# EAGLE design esp32_hub75 (EAGLE 7.7.0)
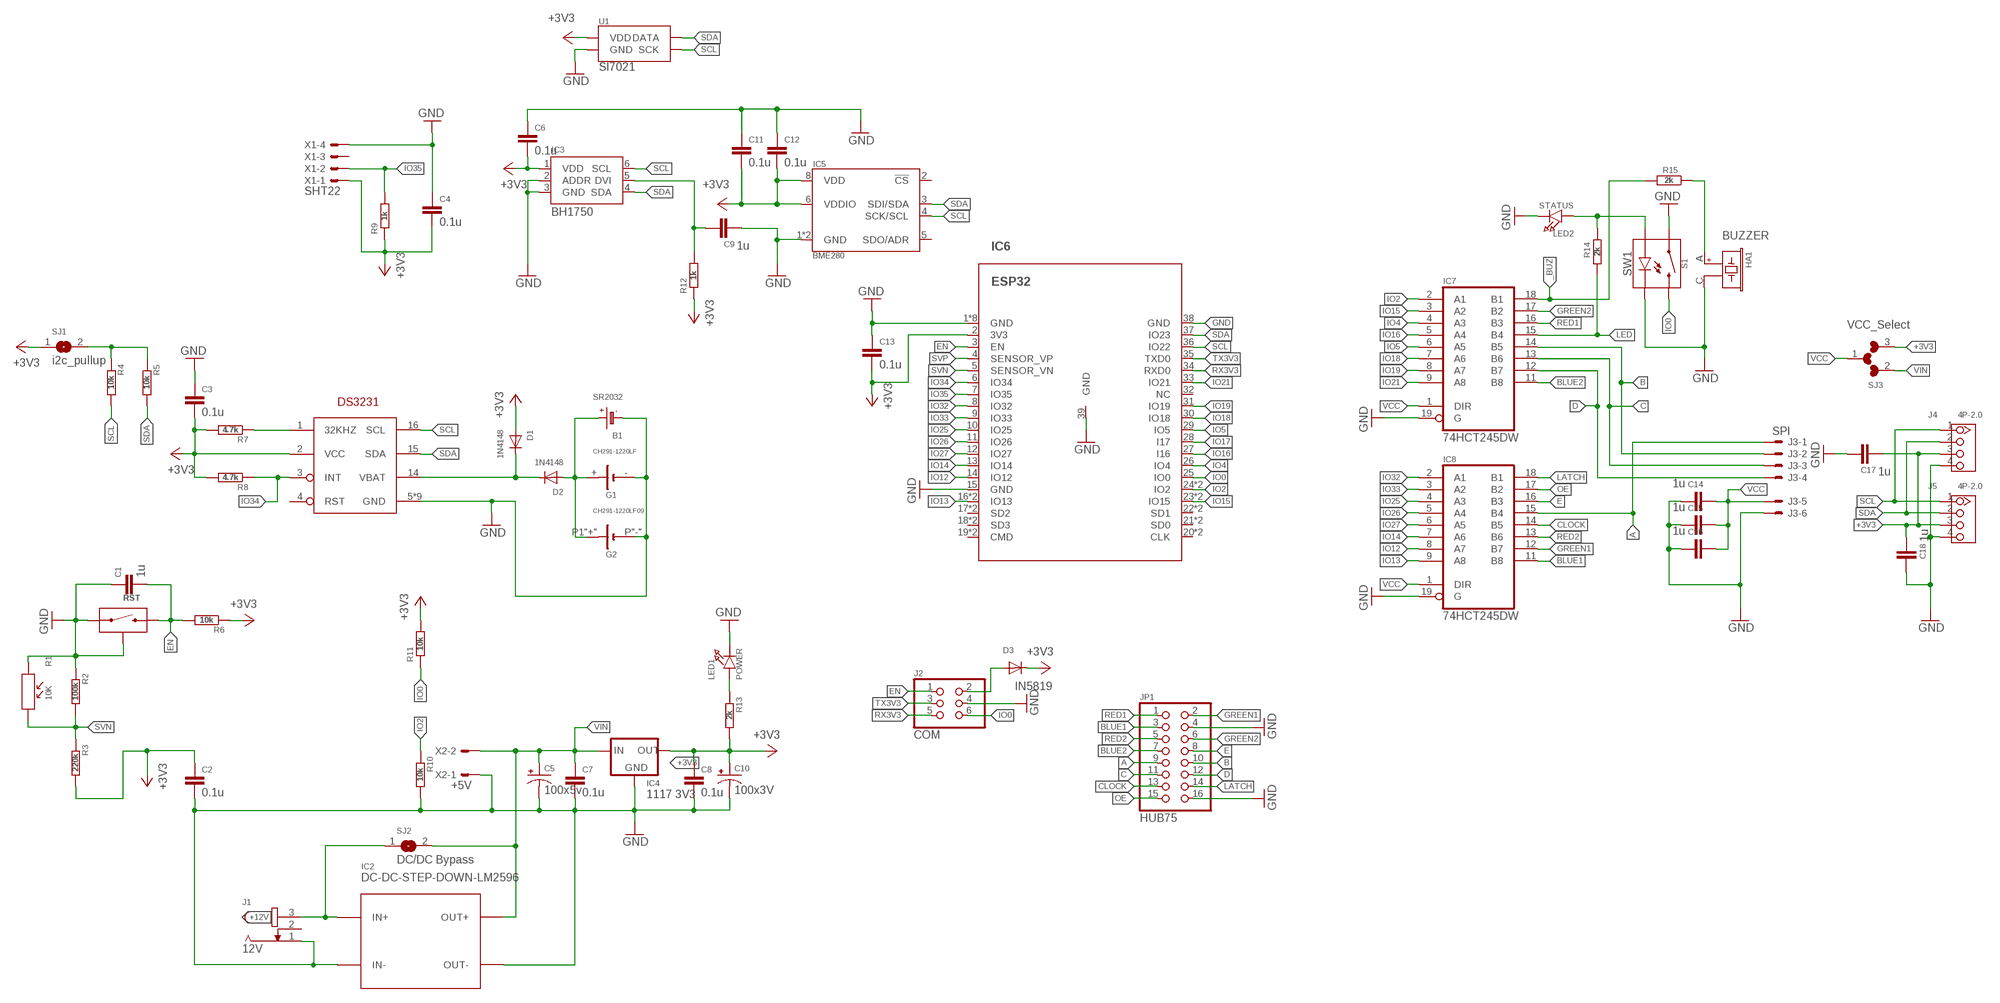
[diagram p0: schematic, sheet 1]

## Parts
B1  SR2032  BATTERYCR2032  [CR2032]
C1  1u  CAP0603-CAP  [0603-CAP]
C2  0.1u  CAP0603-CAP  [0603-CAP]
C3  0.1u  CAP0603-CAP  [0603-CAP]
C4  0.1u  CAP0603-CAP  [0603-CAP]
C5  100x5v  CAP_POLPTH1  [CPOL-RADIAL-100UF-25V]
C6  0.1u  CAP0603-CAP  [0603-CAP]
C7  0.1u  CAP0603-CAP  [0603-CAP]
C8  0.1u  CAP0603-CAP  [0603-CAP]
C9  1u  CAP0603-CAP  [0603-CAP]
C10  100x3V  CAP_POLPTH1  [CPOL-RADIAL-100UF-25V]
C11  0.1u  CAP0603-CAP  [0603-CAP]
C12  0.1u  CAP0603-CAP  [0603-CAP]
C13  0.1u  CAP0603-CAP  [0603-CAP]
C14  1u  CAP0603-CAP  [0603-CAP]
C15  1u  CAP0603-CAP  [0603-CAP]
C16  1u  CAP0603-CAP  [0603-CAP]
C17  1u  CAP0603-CAP  [0603-CAP]
C18  1u  CAP0603-CAP  [0603-CAP]
D1  1N4148  DIODESOD-323F  [SOD-323F]
D2  1N4148  DIODESOD-323F  [SOD-323F]
D3  IN5819  DIODE-SOD123  [SOD123]
G1  CH291-1220LF  [CH291-1220LF]
G2  CH291-1220LF09  [CH23-09LF]
HA1  BUZZER  PIEZO_BUZZERHYDZ12X7.5  [PBUZ_12X7.5]
IC1  DS3231W  [SO16W]
IC2  DC-DC-STEP-DOWN-LM2596  [DC-DC-STEP-DOWN-LM2596]
IC3  BH1750  [WSOF6L]
IC4  1117 3V3  V_REG_LD1117VXXSMD  [SOT223]
IC5  BME280  [LGA-8-2.5X2.5]
IC6  ESP32  ESP32-MODULEDUAL  [ESP32-WROOVER/WROOM]
IC7  74HCT245DW  [SO20W]
IC8  74HCT245DW  [SO20W]
J1  12V  JACK-PLUG0  [SPC4077]
J2  COM  HEADER-2X3TH  [2X03]
J3  SPI  C-GRID-0670543  [70543-06]
J4  4P-2.0  GROVE-CONNECTOR-DIP(4P-2.0)  [HW4-2.0]
J5  4P-2.0  GROVE-CONNECTOR-DIP(4P-2.0)  [HW4-2.0]
JP1  HUB75  PINHD-2X8  [2X08]
LED1  POWER  LED0603  [CHIPLED_0603]
LED2  STATUS  LED0603  [CHIPLED_0603]
R1  10K  PHOTORESISTOR-5528-10K(2P-5.0X4.2MM)  [SNR2-3.0]
R2  100k  R-EU_R0603  [R0603]
R3  220k  R-EU_R0603  [R0603]
R4  10k  R-EU_R0603  [R0603]
R5  10k  R-EU_R0603  [R0603]
R6  10k  R-EU_R0603  [R0603]
R7  4.7k  R-EU_R0603  [R0603]
R8  4.7k  R-EU_R0603  [R0603]
R9  1k  R-EU_R0603  [R0603]
R10  10k  R-EU_R0603  [R0603]
R11  10k  R-EU_R0603  [R0603]
R12  1k  R-EU_R0603  [R0603]
R13  2k  R-EU_R0603  [R0603]
R14  2k  R-EU_R0603  [R0603]
R15  2k  R-EU_R0603  [R0603]
RST  RST  MICROSWITCH-BUTTON  [MICROPUSH-BUT_TOP]
S1  SW1  MOMENTARY-SWITCH-SPST-LED-PTH-12MM-KIT  [TACTILE_SWITCH_LED_PTH_12MM_KIT]
SJ1  i2c_pullup  MICROBUILDER_SOLDERJUMPER  [MICROBUILDER_SOLDERJUMPER_ARROW_NOPASTE]
SJ2  DC/DC Bypass  MICROBUILDER_SOLDERJUMPER  [MICROBUILDER_SOLDERJUMPER_ARROW_NOPASTE]
SJ3  VCC_Select  MICROBUILDER_SOLDERJUMPER3  [MICROBUILDER_SOLDERJUMPER_ARROW_NOPASTE_3]
U1  SI7021  [DFN-6-3X3-SI7021]
X1  SHT22  C-GRID-04-70543  [70543-04]
X2  +5V  C-GRID-02-70543  [70543-02]

## Nets
+3V3: C2.1 C3.2 C4.2 C6.2 C8.1 C10.1(+) C11.2 C12.2 C13.2 C17.2 C18.2 D1.A D3.C IC1.2(VCC) IC3.1(VDD) IC4.2(OUT) IC4.4(OUT) IC5.6(VDDIO) IC5.8(VDD) IC6.2(3V3) J4.3 J5.3 R3.2 R6.1 R7.2 R8.2 R9.1 R11.2 R12.1 R13.2 SJ1.1 SJ3.3 U1.VDD X1.1
+12V: IC2.IN+ J1.3 SJ2.1
_BUZ: IC7.18(B1) R15.2
A: IC8.15(B4) J3.1 JP1.9
B: IC7.14(B5) J3.2 JP1.10
BLUE1: IC8.11(B8) JP1.3
BLUE2: IC7.11(B8) JP1.7
BUZ: HA1.A R15.1
C: IC7.13(B6) J3.3 JP1.11
CLOCK: IC8.14(B5) JP1.13
D: IC7.12(B7) J3.4 JP1.12
E: IC8.16(B3) JP1.8
EN: C1.2 IC6.3(EN) J2.1 R6.2 RST.B
GND: B1.- C1.1 C2.2 C3.1 C4.1 C5.2(-) C6.1 C7.2 C8.2 C9.2 C10.2(-) C11.1 C12.1 C13.1 C14.2 C15.2 C16.2 C17.1 C18.1 G1.- G2.P"-"(-) HA1.C IC1.5(GND) IC1.6(GND) IC1.7(GND) IC1.8(GND) IC1.9(GND) IC1.10(GND) IC1.11(GND) IC1.12(GND) IC1.13(GND) IC2.IN- IC2.OUT- IC3.2(ADDR) IC3.3(GND) IC4.1(GND) IC5.1(GND) IC5.7(GND) IC6.1(GND) IC6.15(GND) IC6.38(GND) IC6.39(GND) IC6.GND IC6.PAD$1(GND) IC6.PAD$4(GND) IC6.PAD$5(GND) IC6.PAD$7(GND) IC6.PAD$8(GND) IC6.PAD$9(GND) IC7.19(G) IC8.19(G) J1.1 J2.4 J3.6 J4.4 J5.4 JP1.4 JP1.16 LED1.C LED2.C R1.1 R2.1 R10.2 RST.A RST.SH0(SH) S1.3 S1.4 S1.C U1.GND X1.4 X2.1
GREEN1: IC8.12(B7) JP1.2
GREEN2: IC7.17(B2) JP1.6
IO0: IC6.25(IO0) J2.6 R11.1 S1.1 S1.2
IO2: IC6.24(IO2) IC6.48(IO2) IC7.2(A1) R10.1
IO4: IC6.26(IO4) IC7.4(A3)
IO5: IC6.29(IO5) IC7.6(A5)
IO12: IC6.14(IO12) IC8.8(A7)
IO13: IC6.16(IO13) IC6.40(IO13) IC8.9(A8)
IO14: IC6.13(IO14) IC8.7(A6)
IO15: IC6.23(IO15) IC6.47(IO15) IC7.3(A2)
IO16: IC6.27(I16) IC7.5(A4)
IO17: IC6.28(I17)
IO18: IC6.30(IO18) IC7.7(A6)
IO19: IC6.31(IO19) IC7.8(A7)
IO21: IC6.33(IO21) IC7.9(A8)
IO25: IC6.10(IO25) IC8.4(A3)
IO26: IC6.11(IO26) IC8.5(A4)
IO27: IC6.12(IO27) IC8.6(A5)
IO32: IC6.8(IO32) IC8.2(A1)
IO33: IC6.9(IO33) IC8.3(A2)
IO34: IC1.3(INT) IC6.6(IO34) R8.1
IO35: IC6.7(IO35) R9.2 X1.2
LATCH: IC8.18(B1) JP1.14
LED: IC7.15(B4) R14.2
N$1: D1.C D2.C IC1.14(VBAT)
N$2: LED1.A R13.1
N$5: LED2.A R14.1 S1.A
N$25: C9.1 IC3.5(DVI) R12.2
N$32: IC1.1(32KHZ) R7.1
N$39: R4.1 R5.1 SJ1.2
N$47: D3.A J2.2
N$52: B1.+ D2.A G1.+ G2.P1"+"(+)
OE: IC8.17(B2) JP1.15
RED1: IC7.16(B3) JP1.1
RED2: IC8.13(B6) JP1.5
RX3V3: IC6.34(RXD0) J2.5
SCL: IC1.16(SCL) IC3.6(SCL) IC5.4(SCK/SCL) IC6.36(IO22) J4.1 J5.1 R4.2 U1.SCK
SDA: IC1.15(SDA) IC3.4(SDA) IC5.3(SDI/SDA) IC6.37(IO23) J4.2 J5.2 R5.2 U1.DATA
SVN: IC6.5(SENSOR_VN) R1.2 R2.2 R3.1
SVP: IC6.4(SENSOR_VP)
TX3V3: IC6.35(TXD0) J2.3
VCC: C14.1 C15.1 C16.1 IC7.1(DIR) IC8.1(DIR) J3.5 SJ3.1
VIN: C5.1(+) C7.1 IC2.OUT+ IC4.3(IN) SJ2.2 SJ3.2 X2.2
Unconnected: IC1.4(RST) IC5.2(!CS) IC5.5(SDO/ADR) IC6.17(SD2) IC6.18(SD3) IC6.19(CMD) IC6.20(CLK) IC6.21(SD0) IC6.22(SD1) IC6.32(NC) IC6.41(SD2) IC6.42(SD3) IC6.43(CMD) IC6.44(CLK) IC6.45(SD0) IC6.46(SD1) J1.2 X1.3

## Power pins joined to a net without a drawn wire
GND: IC7.10(GND) IC8.10(GND)
VCC: IC7.20(VCC) IC8.20(VCC)

## Library data of the parts
B1 = radiva5:BATTERY: CR1220 SMT - Digikey: 3001K-ND
C1-C4 C6-C9 C11-C18 = radiva5:CAP: Capacitor Standard 0603 ceramic capacitor, and 0.1" leaded capacitor.
C5 C10 = radiva5:CAP_POL: Capacitor Polarized These are standard SMD and PTH capacitors. Normally 10uF, 47uF, and 100uF in electrolytic and tantalum varieties. Always verify the external diameter of the through hole cap, it varies with capacity, voltage, and manufacturer. The EIA devices should be standard.
D1 D2 = clock02:DIODE: Diode SMADIODE - SMA Surface Mount Package 20V 1A Schottky Diode Digikey: 641-1014-6-ND DO-1N4148 - Through Hole Small Current Diode SOD-123 20V 1 A (.5mV Vf) Schottky Diode - Digikey: MBRX120TPMSCT-ND SOD-323 10V 570mA (.38mV Vf, 3ns) Schottky Diode - Digikey: ZLLS410CT-ND SOD-523 30V 30mA Schottky Diode (RB751S-40TE61) - Digikey: RB751S-40TE61CT-ND SOT23-R/W - SOT23 Package (R = Solder Paste/Reflow Ovens, W = Hand-Soldering) BAT54Film 40V 300mA - Digikey: 497-7162-1-ND
D3 = radiva5:DIODE-: DIODE
G1 G2 = clock02:CH291-1220LF: Battery Holder, SMT, 12mm multicomp PART NO. CH291-1220LF Source: Data sheet <http://www.farnell.com/datasheets/1505860.pdf>
HA1 = radiva5:PIEZO_BUZZER: Generic Piezo Buzzer Package(s): 12 mm dia, 7.6 mm (Pitch)
IC1 = radiva5:DS3231
IC2 = diy-modules:DC-DC-STEP-DOWN-LM2596: DC/DC Step-Down Regulator based on LM2596-ADJ chip LM2596 datasheet available here: http://www.ti.com/lit/ds/symlink/lm2596.pdf Click here to find device on ebay.com <http://www.ebay.com/sch/lm2596+power+regulator>
IC3 = radiva5:BH1750; PROD_ID: IC-13876; VALUE: ZOPT2201
IC4 = radiva5:V_REG_LD1117VXX: LD1117VXX voltage regulator. We carry the 3.3V version (COM-00526) in TO-220 package.; PROD_ID: VREG-13917
IC5 = radiva5:BME280: Bosch BME280 – Combined Humidity and Pressure Sensor The BME280 is as combined digital humidity, pressure and temperature sensor based on proven sensing principles. The sensor module is housed in an extremely compact metal-lid LGA package with a footprint of only 2.5×2.5mm² with a height of 0.93mm. Its small dimensions and its low power consumption allow the implementation in battery driven devices such as handsets, GPS modules or watches. Datasheet <https://cdn.sparkfun.com/assets/learn_tutorials/4/1/9/BST-BME280_DS001-10.pdf> SparkFun Products SparkFun Atmospheric Sensor Breakout - BME280 <https://www.sparkfun.com/products/13676> (SEN-13676); PROD_ID: IC-13090
IC6 = radiva5:ESP32-MODULE
IC7 IC8 = 74xx-eu:74*245: Octal BUS TRANSCEIVER, 3-state
J1 = con-jack:JACK-PLUG: DC POWER JACK Power Jack, DC, Right Angle, Through Hole, Rated 5A at 16VDC, PC Terminals Distributor: Farnell (www.Farnell.de) Drawing: 84N1161.pdf / 84N1162.pdf Manufacturer: SPC Technology (www.spctechnology.com) Type: SPC4077 / SPC 4078; OC_FARNELL: unknown; OC_NEWARK: unknown
J2 = radiva5:HEADER-2X3: PIN HEADER
J3 = clock02:C-GRID-06: CONNECTOR wire to board 2.54 mm (0.100") pitch header
J4 J5 = radiva5:GROVE-CONNECTOR-DIP(4P-2.0): 320110033
JP1 = pinhead:PINHD-2X8: PIN HEADER
LED1 LED2 = radiva5:LED: LED 0603 - 0603 Surface Mount Package 2mA: Green LED - Low Power (3.9mcd, 2ma, 1.7Vf) - Digikey: 475-2709-2-ND Orange LED - Low Power (9.8mcd, 2ma, 1.8Vf) - Digikey: 475-1194-2-ND Red LED - Low Power (5mcd, 2ma, 1.8Vf) - Digikey: 475-1195-2-ND Yellow LED - Low Power (7mcd, 2ma, 1.8Vf) - Digikey: 475-1196-2-ND 5mA: Blue LED - Low Power (17mcd, 5ma, 2.9Vf) - Digikey: LNJ937W8CRACT-ND 0805 - 0805 Surface Mount Package 2mA: Red LED (8.8mcd, 2mA, 1.8Vf, Clear) - Low Power [Digikey: 475-2510-1-ND] Green LED (5mcd, 2mA, 1.8Vf, Clear) - Low Power [Digikey: 475-2730-1-ND] Yellow LED (11.3mcd, 2mA, 1.8Vf, Clear) - Low Power [Digikey: 475-2555-1-ND] 20mA: Red LED (104mcd, 20mA, Diffused) - LS R976 [Digikey: 475-1278-6-ND] Red LED (12mcd, 20mA, 2.0Vf, Clear) - APT2012EC [Digikey: 754-1128-1-ND] Green LED (15mcd, 20mA, 2.2Vf, Clear) - APT2012GC [Digikey: 754-1131-1-ND] Orange LED (160mcd, 20mA, 2.1Vf, Clear) - APT2012SECK [Digikey: 754-1130-1-ND] 1206 - 1206 Surface Mount Package Green LED (26mcd, 20mA, Diffused) - LG N971 [Digikey: 475-1407-6-ND] Red LED (15mcd, 20mA, Diffused) - LH N974 [Digikey: 475-1416-6-ND]
R1 = radiva5:PHOTORESISTOR-5528-10K(2P-5.0X4.2MM): 314020017; MPN: PHOTORESISTOR-5528-10K; VALUE: PHOTORESISTOR-5528-10K
R2-R15 = radiva5:R-EU_: RESISTOR, European symbol
RST = radiva5:MICROSWITCH-BUTTON
S1 = radiva5:MOMENTARY-SWITCH-SPST-LED: Momentary Switch (Pushbutton) - SPST - w/ LED Normally-open (NO) SPST momentary switches (buttons, pushbuttons), with a built-in LED. Variants PTH-CHERRY - Cherry MX Switch Cherry MX Keyswitches are top-of-the-line mechanical keyboard switches. Theyre satisfyingly clicky, reliable up to tens-of-millions of key presses, and a standard in gaming and programming keyboards across the globe. This blue version Cherry MX Switch is favored by most due to its secondary internal actuator making it less likely to double-tap. If you are looking for a noticeably audible and high-quality key switch, this is the perfect option for you! Cherry MX Switch <https://www.sparkfun.com/products/13834> (COM-13834) Cherry MX Switch Breakout <https://www.sparkfun.com/products/13773> (BOB-13773) PTH-12MM and PTH-12MM-KIT - 12mm Illuminated LED KIT variant is for soldering kits. There is no tStop (covering up the top side of the pads with mask). This helps the beginner see which side they should be soldering too. LED Tactile Button Breakout <https://www.sparkfun.com/products/10467> (BOB-10467) LED Tactile Button - Red <https://www.sparkfun.com/products/10442> (COM-10442) LED Tactile Button - Blue <https://www.sparkfun.com/products/10443> (COM-10443) LED Tactile Button - Green <https://www.sparkfun.com/products/10440> (COM-10440) LED Tactile Button - Orange <https://www.sparkfun.com/products/10441> (COM-10441) LED Tactile Button - White <https://www.sparkfun.com/products/10439> (COM-10439); PROD_ID: SWCH-11758; SF_SKU: COM-10442
SJ1 SJ2 = radiva5:MICROBUILDER_SOLDERJUMPER: SMD Solder JUMPER Solder the two pads together to create a connection, or remove the solder to break it. REFLOW - Use this footprint for solder paste and reflow ovens. WAVE - Use this footprint for hand-soldering (larger pads). CLOSED - Has a trace between the two pads to ensure it is closed by default. The trace needs to be cut to disable the jumper, and can be closed again by creating a solder bridge between the two pads.; BOM: EXCLUDE
SJ3 = radiva5:MICROBUILDER_SOLDERJUMPER3: SMD Solder JUMPER Solder the two pads together to create a connection, or remove the solder to break it. REFLOW - Use this footprint for solder paste and reflow ovens. WAVE - Use this footprint for hand-soldering (larger pads). CLOSED - Has a trace between the two pads to ensure it is closed by default. The trace needs to be cut to disable the jumper, and can be closed again by creating a solder bridge between the two pads.
U1 = radiva5:SI7021: Silicon Labs Si7021 I2C Humidity and Temperature Sensor The Si7021 is a low-cost, easy-to-use, highly accurate, digital humidity and temperature sensor. This sensor is ideal for environmental sensing and data logging and perfect for build a weather stations or humidor control system. All you need are two lines for I2C communication, and you’ll have relative humidity readings and very accurate temperature readings as a bonus! Datasheet <https://cdn.sparkfun.com/datasheets/Sensors/Weather/Si7021.pdf> SparkFun Products SparkFun Humidity and Temperature Sensor Breakout - Si7021 <https://www.sparkfun.com/products/13763> (SEN-13763) SparkFun Blynk Board - ESP8266 <https://www.sparkfun.com/products/13794> (WRL-13794); PROD_ID: IC-13093
X1 = con-molex:C-GRID-04: CONNECTOR wire to board 2.54 mm (0.100") pitch header; OC_FARNELL: unknown; OC_NEWARK: unknown
X2 = con-molex:C-GRID-02: CONNECTOR wire to board 2.54 mm (0.100") pitch header; OC_FARNELL: unknown; OC_NEWARK: unknown

## Net classes
0 default: clearance 0.205 mm
1 power: width 0.406 mm

## Board
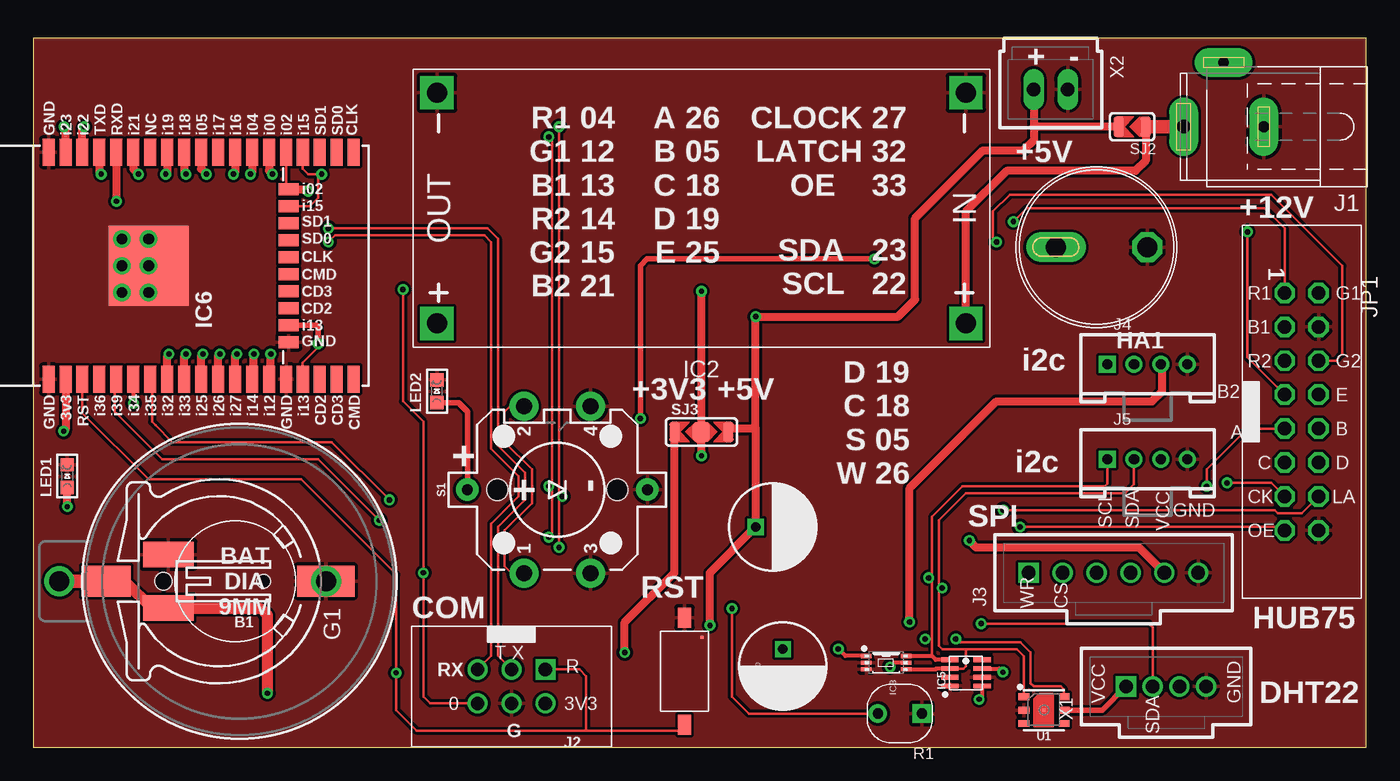
[diagram p1: board, top side]
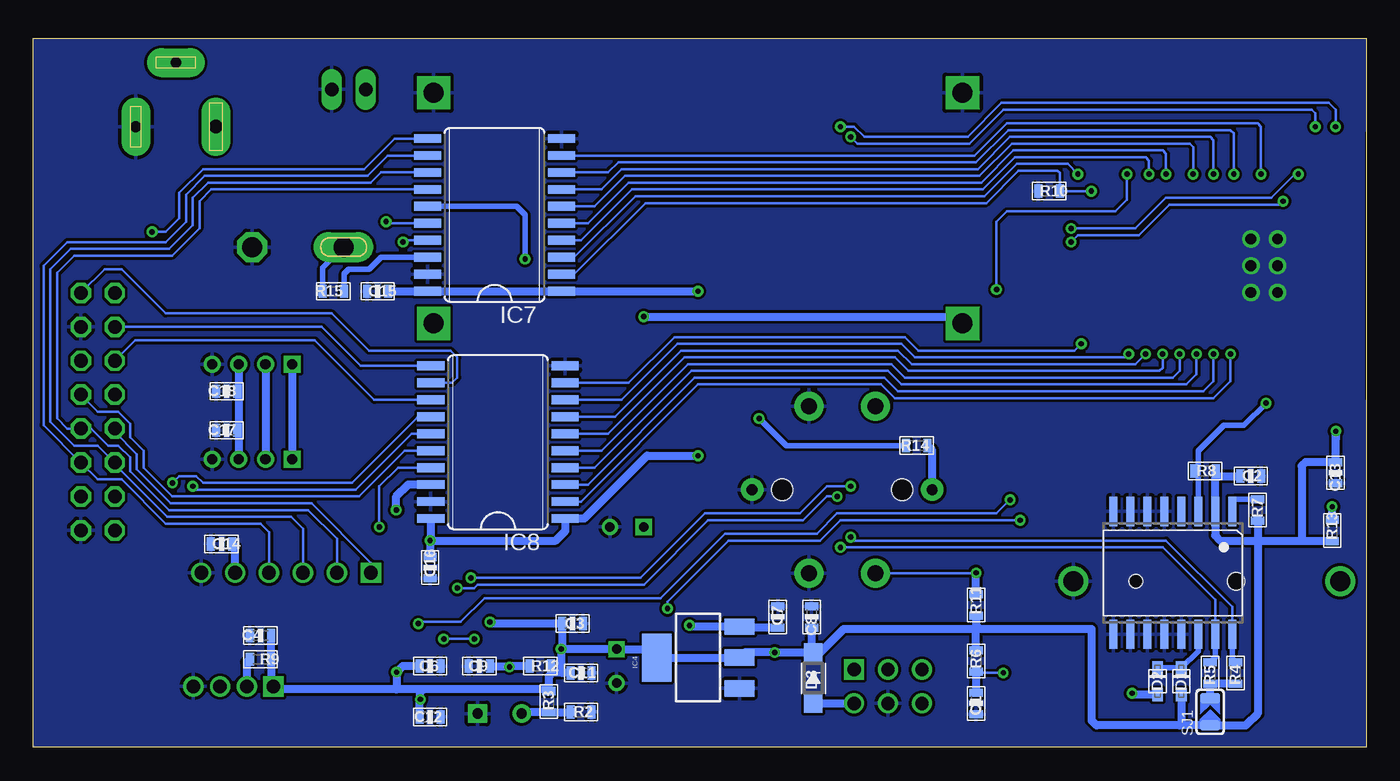
[diagram p2: board, bottom side, seen from below]

Size 99.82 x 53.09 mm. Coordinates in mm from the lower left corner, seen from the top.
Outline: 0,53.09 0,0 99.82,0 99.82,53.09 0,53.09
Copper layers (1*16): Top 0.035mm / dielectric 1.5mm / Bottom 0.035mm
Design rules "default *": minimum track width 8mil, minimum drill 15mil, track to track 8mil, track to pad 8mil, pad to pad 8mil, via to via 8mil, smd to smd 8mil, copper to edge 1mil, drill to drill 8mil, minimum pad ring 10mil, minimum via ring 8mil, stop-mask expansion 4mil, vias tented up to drill 20mil, thermal gap 10mil

### Footprints (pad centres in the part's own frame; a part is rotated, then mirrored left to right if it is on the bottom)
CR2032 = drill 1.5: + 13.81,0; - -6.19,0
0603-CAP = smd 0.6 x 1: 1 -0.8,0; 2 0.8,0
CPOL-RADIAL-100UF-25V = drill 0.7 square: 1 1.27,0 | drill 0.7: 2 -1.27,0
SOD-323F = smd 1 x 0.8: A -1,0; C 1,0
SOD123 = smd 1.4 x 1.4: A 1.9,0; C -1.9,0
CH291-1220LF = smd 2.3 x 3.66: + 0,-2.296 | smd 2.3 x 4.3: - 0,14.146 | hole 1.3: 0,2 | hole 1: 0,9.5
CH23-09LF = smd 3.81 x 1.93: P1"+" 5,2; P"-" 5,-2
PBUZ_12X7.5 = drill 1.5 long: A 3.038,0 | drill 1.5 octagon: C -3.8,0
SO16W = smd 0.6 x 2.2: 1 -4.445,-4.6; 2 -3.175,-4.6; 3 -1.905,-4.6; 4 -0.635,-4.6; 5 0.635,-4.6; 6 1.905,-4.6; 7 3.175,-4.6; 8 4.445,-4.6; 9 4.445,4.6; 10 3.175,4.6; 11 1.905,4.6; 12 0.635,4.6; 13 -0.635,4.6; 14 -1.905,4.6; 15 -3.175,4.6; 16 -4.445,4.6
DC-DC-STEP-DOWN-LM2596 = drill 1.5 pad 2.5 square: IN+ -19.812,8.636; IN- -19.812,-8.636; OUT+ 19.812,8.636; OUT- 19.812,-8.636
WSOF6L = smd 0.3 x 0.8: 1 -0.5,-1.5; 2 0,-1.5; 3 0.5,-1.5; 4 0.5,1.5; 5 0,1.5; 6 -0.5,1.5
SOT223 = smd 1.219 x 2.235: 1 -2.311,-3.099; 2 0,-3.099; 3 2.311,-3.099 | smd 3.6 x 2.2: 4 0,3.099
LGA-8-2.5X2.5 = smd 0.35 x 1.3: 1 -0.975,1.2; 2 -0.325,1.2; 3 0.325,1.2; 4 0.975,1.2; 5 0.975,-1.2; 6 0.325,-1.2; 7 -0.325,-1.2; 8 -0.975,-1.2
ESP32-WROOVER/WROOM = smd 2 x 0.9: 1 -8.5,7.5; 2 -8.5,6.23; 3 -8.5,4.96; 4 -8.5,3.69; 5 -8.5,2.42; 6 -8.5,1.15; 7 -8.5,-0.12; 8 -8.5,-1.39; 9 -8.5,-2.66; 10 -8.5,-3.93; 11 -8.5,-5.2; 12 -8.5,-6.47; 13 -8.5,-7.74; 14 -8.5,-9.01; 15 -8.5,-10.28; 16 -8.5,-11.55; 17 -8.5,-12.82; 18 -8.5,-14.09; 19 -8.5,-15.36; 20 8.5,-15.36; 21 8.5,-14.09; 22 8.5,-12.82; 23 8.5,-11.55; 24 8.5,-10.28; 25 8.5,-9.01; 26 8.5,-7.74; 27 8.5,-6.47; 28 8.5,-5.2; 29 8.5,-3.93; 30 8.5,-2.66; 31 8.5,-1.39; 32 8.5,-0.12; 33 8.5,1.15; 34 8.5,2.42; 35 8.5,3.69; 36 8.5,4.96; 37 8.5,6.23; 38 8.5,7.5 | smd 0.9 x 1.5: 39 -5.725,-10.5; 40 -4.445,-10.5; 41 -3.175,-10.5; 42 -1.905,-10.5; 43 -0.635,-10.5; 44 0.635,-10.5; 45 1.905,-10.5; 46 3.175,-10.5; 47 4.445,-10.5; 48 5.715,-10.5 | smd 6 x 6: GND 0,0 | drill 0.8: PAD$1 -2,2; PAD$4 0,2; PAD$5 2,2; PAD$7 -2,0; PAD$8 0,0; PAD$9 2,0
SO20W = smd 0.66 x 2.032: 1 -5.715,-5.029; 2 -4.445,-5.029; 3 -3.175,-5.029; 4 -1.905,-5.029; 5 -0.635,-5.029; 6 0.635,-5.029; 7 1.905,-5.029; 8 3.175,-5.029; 9 4.445,-5.029; 10 5.715,-5.029; 11 5.715,5.029; 12 4.445,5.029; 13 3.175,5.029; 14 1.905,5.029; 15 0.635,5.029; 16 -0.635,5.029; 17 -1.905,5.029; 18 -3.175,5.029; 19 -4.445,5.029; 20 -5.715,5.029
SPC4077 = drill 0.8 pad 2.184 long: 1 -3,0; 2 0,-4.8 | drill 1 pad 2.184 long: 3 3,0
2X03 = drill 1 square: 1 -2.54,-1.27 | drill 1: 2 -2.54,1.27; 3 0,-1.27; 4 0,1.27; 5 2.54,-1.27; 6 2.54,1.27
70543-06 = drill 1.016 square: 1 -5.08,0 | drill 1.016: 2 -2.54,0; 3 0,0; 4 2.54,0; 5 5.08,0; 6 7.62,0
HW4-2.0 = drill 0.762 pad 1.27 square: 1 -3,0 | drill 0.762 pad 1.27: 2 -1,0; 3 1,0; 4 3,0
2X08 = drill 1.016 octagon: 1 -8.89,-1.27; 2 -8.89,1.27; 3 -6.35,-1.27; 4 -6.35,1.27; 5 -3.81,-1.27; 6 -3.81,1.27; 7 -1.27,-1.27; 8 -1.27,1.27; 9 1.27,-1.27; 10 1.27,1.27; 11 3.81,-1.27; 12 3.81,1.27; 13 6.35,-1.27; 14 6.35,1.27; 15 8.89,-1.27; 16 8.89,1.27
CHIPLED_0603 = smd 1 x 1: A 0,-0.85; C 0,0.85
SNR2-3.0 = drill 0.762 pad 1.397 square: 1 -1.651,0 | drill 0.762 pad 1.397: 2 1.651,0
R0603 = smd 0.6 x 1: 1 -0.8,0; 2 0.8,0
MICROPUSH-BUT_TOP = smd 1.5 x 1: A -4,0; B 4,0 | smd 0.2 x 0.2: SH0 -2.54,1.31
TACTILE_SWITCH_LED_PTH_12MM_KIT = drill 1.2 pad 2.159: 1 -6.25,2.5; 2 6.25,2.5; 3 -6.25,-2.5; 4 6.25,-2.5 | drill 0.8 pad 1.676: A 0,6.75; C 0,-6.75 | hole 1.6: 0,4.5; 0,-4.5
MICROBUILDER_SOLDERJUMPER_ARROW_NOPASTE = smd 0.762 x 1.524: 1 -1.016,0; 2 1.016,0
MICROBUILDER_SOLDERJUMPER_ARROW_NOPASTE_3 = smd 1.27 x 1.524: 1 0,0 | smd 0.762 x 1.524: 2 2.032,0; 3 -2.032,0
DFN-6-3X3-SI7021 = smd 0.2 x 0.2: 7 0,0 | smd 0.8 x 0.5: DATA 1.5,-1; GND 1.5,0; NC@3 1.5,1; NC@4 -1.5,1; SCK -1.5,-1; VDD -1.5,0
70543-04 = drill 1.016 square: 1 -3,0 | drill 1.016: 2 -1,0; 3 1,0; 4 3,0
70543-02 = drill 1.016 long: 1 -1.27,0; 2 1.27,0

### Placement (x,y rotation side)
B1  15.75,12.45 180 top
C1  29.21,3.3 90 bottom
C2  8.64,20.32 0 bottom
C3  59.44,9.27 180 bottom
C4  82.8,8.38 0 bottom
C5  55.37,16.51 180 top
C6  70.1,6.1 180 bottom
C7  44.07,9.78 90 bottom
C8  41.53,9.78 90 bottom
C9  66.42,6.1 180 bottom
C10  56.13,6.1 90 top
C11  58.8,5.59 180 bottom
C12  70.1,2.29 180 bottom
C13  2.29,20.57 90 bottom
C14  85.72,15.24 180 bottom
C15  74.04,34.16 180 bottom
C16  70.1,13.46 270 bottom
C17  85.34,23.75 0 bottom
C18  85.34,26.67 0 bottom
D1  13.84,4.95 90 bottom
D2  15.62,4.95 90 bottom
D3  41.4,5.21 270 bottom
G1  7.75,12.45 270 top
G2  15.11,12.45 180 top
HA1  79.63,37.47 180 top
IC1  14.48,13.08 180 bottom
IC2  50.04,40.39 180 top
IC3  63.88,6.35 270 top
IC4  50.04,6.73 90 bottom
IC5  69.85,5.59 90 top
IC6  8.64,36.07 90 top
IC7  65.28,39.88 90 bottom
IC8  65.02,22.86 90 bottom
J1  89.15,46.48 180 top
J2  35.81,4.57 180 top
J3  79.63,13.08 0 top
J4  83.44,28.7 0 top
J5  83.44,21.59 0 top
JP1  95,25.15 270 top
LED1  2.54,20.32 0 top
LED2  30.23,26.67 0 top
R1  64.9,2.54 180 top
R2  58.8,2.67 180 bottom
R3  61.21,3.43 90 bottom
R4  9.78,5.59 90 bottom
R5  11.68,5.59 90 bottom
R6  29.21,6.48 270 bottom
R7  8.13,17.78 270 bottom
R8  12.06,20.7 0 bottom
R9  82.8,6.6 180 bottom
R10  23.75,41.66 180 bottom
R11  29.21,10.67 270 bottom
R12  61.85,6.1 180 bottom
R13  2.54,16.26 270 bottom
R14  33.66,22.61 180 bottom
R15  77.34,34.16 0 bottom
RST  48.77,5.71 270 top
S1  39.24,19.3 90 top
SJ1  11.68,2.67 90 bottom
SJ2  82.3,46.48 180 top
SJ3  50.04,23.62 0 top
U1  75.69,2.79 180 top
X1  84.84,4.57 0 top
X2  76.2,49.28 180 top

### Tracks (layer width: path | path; a pad name or v marks a point on that pad's centre or on a via)
+3V3  (via drill 0.38, 0.4)
  Top 0.305: IC3.1 60.81,6.85 v60.29,7.37 | IC5.8 71.05,3.82 v70.84,3.61 | IC5.6 72.34,5.91 v72.62,5.64
  Top 0.406: U1.VDD 80.06,2.79 X1.1
  Top 0.61: IC6.2 2.41,23.82 v2.27,23.69 | SJ3.3 48.01,13.08 44.29,9.36 v44.29,7.11 | J4.3 84.54,28.6 C18.2 83.78,25.91 72.14,25.91 65.62,19.4 v65.62,9.4
  Bottom 0.61: 2.27,23.15 v2.27,23.69 2.29,23.67 C13.2 4.53,21.37 4.83,21.08 4.83,15.46 | C2.1 11.26,20.32 R8.2 11.3,20.66 IC1.2 11.3,15.88 10.92,15.49 8.13,15.49 | J4.3 84.44,26.67 | 84.44,26.67 84.44,23.75 | 84.44,23.75 J5.3 | C18.2 84.44,26.67 | C17.2 84.44,23.75 | v60.29,7.37 C10.1 53.77,7.37 IC4.4 IC4.2 46.56,7.11 v44.29,7.11 v44.28,7.11 D3.C | v60.29,7.36 v60.29,7.37 | 72.57,5.59 v72.62,5.64 | 60.24,7.31 v60.29,7.37 | v60.29,7.37 60.24,7.42 C3.2 65.53,9.27 65.62,9.36 v65.62,9.4 | R7.2 8.13,15.49 | 8.13,15.49 8.13,2.54 9.02,1.65 SJ1.1 13.97,1.65 | 13.97,1.65 20.19,1.65 20.57,2.03 20.57,8.89 28.96,8.89 | 29.21,8.89 39.12,8.89 40.9,7.11 D3.C | 29.21,8.89 28.96,8.89 | C11.2 60.2,5.59 | 60.2,5.59 60.96,5.59 | 60.96,5.59 61.21,5.33 R3.2 61.34,4.36 70.61,4.36 | v60.29,7.37 60.29,5.68 60.2,5.59 | R12.1 61.05,5.68 60.96,5.59 | C4.2 R9.1 82,4.74 X1.1 81.62,4.36 72.64,4.36 | C6.2 72.16,6.1 v72.62,5.64 | 70.61,4.36 72.64,4.36 | v72.62,5.64 72.62,4.39 72.64,4.36 | 70.61,4.36 70.84,4.13 v70.84,3.61 70.9,3.54 C12.2 | R13.2 4.83,15.46 | 4.83,15.46 8.09,15.46 8.13,15.49 | D1.A 13.84,1.78 13.97,1.65 | R6.1 29.21,8.89 | R11.2 29.21,9.14 28.96,8.89 | C8.1 41.53,7.23 D3.C
+12V
  Top 0.61: SJ2.1 83.31,43.94 82.55,43.18 72.9,43.18 69.85,40.13 IC2.IN+
  Top 1.016: J1.3 SJ2.1
_BUZ
  Bottom 0.406: IC7.18 73.79,36.7 74.68,35.81 76.2,35.81 76.54,35.47 R15.2
A  (via drill 0.4)
  Top 0.203: v87.88,19.56 87.88,20.83 90.93,23.88 JP1.9
  Bottom 0.203: JP1.9 93.73,23.62 92.07,21.97 92.07,20.83 89.53,18.29 78.99,18.29 74.55,13.84 J3.1 | IC8.15 71.5,23.49 75.69,19.3 87.63,19.3 v87.88,19.56
B
  Bottom 0.203: J3.2 77.09,15.62 79.25,17.78 89.66,17.78 92.58,20.7 92.58,21.72 93.47,22.61 94.23,22.61 95.5,23.88 JP1.10 97.28,23.88 98.04,24.64 98.04,35.56 96.77,36.83 89.41,36.83 87.38,38.86 87.38,40.89 86.49,41.78 IC7.14
BLUE1
  Bottom 0.203: JP1.3 78.23,31.5 75.31,28.57 IC8.11
BLUE2  (via drill 0.4)
  Top 0.203: v90.93,38.61 90.93,29.21 JP1.7
  Bottom 0.203: IC7.11 72.77,45.59 75.06,43.31 87.12,43.31 88.9,41.53 88.9,39.62 89.92,38.61 v90.93,38.61
BUZ
  Bottom 0.406: R15.1 78.14,35.91 HA1.A
C
  Bottom 0.203: J3.3 79.63,16.38 80.52,17.27 89.79,17.27 93.73,21.21 JP1.11 95,22.61 96.77,22.61 98.55,24.38 98.55,35.81 97.03,37.34 89.66,37.34 87.88,39.12 87.88,41.15 86.74,42.29 74.55,42.29 73.79,43.05 IC7.13
CLOCK  (via drill 0.4)
  Top 0.203: v89.41,19.81 92.71,19.81 JP1.13
  Bottom 0.203: IC8.14 70.05,24.69 71.07,24.69 75.95,19.81 87.12,19.81 87.63,20.32 88.9,20.32 v89.41,19.81
D
  Bottom 0.203: J3.4 82.17,16.13 82.8,16.76 89.92,16.76 93.22,20.07 95,20.07 JP1.12 99.06,24.13 99.06,36.07 97.28,37.85 89.92,37.85 88.39,39.37 88.39,41.4 87,42.8 74.8,42.8 73.28,44.32 IC7.12
E
  Bottom 0.203: JP1.8 95,25.15 93.47,25.15 92.58,24.26 92.58,23.24 91.57,22.22 91.57,20.95 89.41,18.8 75.44,18.8 72.01,22.22 IC8.16
EN  (via drill 0.38)
  Top 0.203: IC6.3 3.68,25.03 8.64,20.07 20.07,20.07 27.18,12.95 v27.18,5.59 27.18,2.79 28.7,1.27 41.4,1.27 | 41.4,1.27 48.32,1.27 RST.B | J2.1 40.89,5.84 41.4,5.33 41.4,1.27
  Bottom 0.203: R6.2 29.3,5.59 v27.18,5.59
  Bottom 0.61: R6.2 C1.2
GND
  pour Top: 99.82,0 99.82,53.09 0,53.09 0,0
  pour Bottom: 99.82,0 99.82,53.09 0,53.09 0,0
GREEN1
  Bottom 0.203: JP1.2 94.49,35.81 93.22,35.81 89.92,32.51 77.47,32.51 74.68,29.72 68.58,29.72 68.07,29.21 68.07,27.69 68.45,27.3 IC8.12
GREEN2  (via drill 0.4)
  Top 0.203: JP1.6 97.54,28.96 98.04,29.46 98.04,36.07 92.71,41.4 73.15,41.4 71.88,40.13 71.88,38.1 v72.14,37.85
  Bottom 0.203: IC7.17 72.01,37.97 v72.14,37.85
IO0  (via drill 0.38, 0.4)
  Top 0.203: J2.6 29.72,3.3 29.21,3.81 v29.21,13.08 29.21,24.38 27.69,25.91 v27.69,34.29 | S1.2 35.71,25.55 35.31,25.15 35.31,22.86 37.34,20.83 37.34,18.29 35.31,16.26 35.31,13.56 35.81,13.05 S1.1
  Top 0.61: IC6.25 17.65,43.19 v17.91,42.93
  Bottom 0.203: v27.69,34.29 27.69,39.37 26.92,40.13 18.8,40.13 17.91,41.02 v17.91,42.93 | S1.1 29.24,13.05 v29.21,13.08
  Bottom 0.61: R11.1 v29.21,13.08
IO2  (via drill 0.4)
  Top 0.203: IC6.24 18.92,42 IC6.48
  Top 0.61: IC6.48 20.45,41.78 v20.57,41.66
  Bottom 0.203: v20.57,41.66 R10.1 22.95,43.02 23.11,43.18 26.03,43.18 28.45,40.77 53.97,40.77 59.31,35.43 IC7.2
IO4  (via drill 0.4)
  Top 0.61: IC6.26 16.38,43.05 v16.26,42.93
  Bottom 0.203: v16.26,42.93 16.26,43.94 16.51,44.2 26.29,44.2 28.7,41.78 54.99,41.78 58.8,37.97 IC7.4
IO5  (via drill 0.4)
  Top 0.61: IC6.29 12.57,43.31 v12.95,42.93
  Bottom 0.203: v12.95,42.93 12.95,44.96 13.21,45.21 26.54,45.21 28.96,42.8 55.5,42.8 57.78,40.51 IC7.6
IO12  (via drill 0.4)
  Top 0.203: 17.78,27.7 IC6.14
  Top 0.61: 17.78,27.7 v17.78,29.46
  Bottom 0.203: IC8.8 55.75,26.04 51.56,30.23 34.8,30.23 33.78,29.21 18.03,29.21 v17.78,29.46
IO13  (via drill 0.4)
  Top 0.203: IC6.16 20.19,28.82 21.34,29.97 v21.34,30.23
  Top 0.406: IC6.40 21.21,31.62 21.34,31.5 v21.34,30.23
  Bottom 0.203: IC8.9 55.24,27.3 51.82,30.73 34.54,30.73 33.53,29.72 21.84,29.72 v21.34,30.23
IO14  (via drill 0.4)
  Top 0.203: 16.51,27.7 IC6.13
  Top 0.61: 16.51,27.7 v16.51,29.46
  Bottom 0.203: IC8.7 56.26,24.77 51.31,29.72 35.05,29.72 34.04,28.7 17.27,28.7 v16.51,29.46
IO15  (via drill 0.4)
  Top 0.203: IC6.23 20.19,43.31 20.57,42.93 21.34,42.93 | IC6.47 20.7,40.51 21.34,41.15 21.34,42.93 | 21.34,42.93 v21.59,42.93
  Bottom 0.203: v21.59,42.93 22.35,43.69 26.16,43.69 28.57,41.27 54.74,41.27 59.31,36.7 IC7.3
IO16  (via drill 0.4)
  Top 0.61: IC6.27 15.11,43.05 v14.99,42.93
  Bottom 0.203: IC7.5 58.29,39.24 55.24,42.29 28.83,42.29 26.42,44.7 15.24,44.7 14.99,44.45 v14.99,42.93
IO18  (via drill 0.4)
  Top 0.61: IC6.30 11.3,43.06 v11.43,42.93
  Bottom 0.203: v11.43,42.93 11.43,45.47 11.68,45.72 26.67,45.72 29.08,43.31 55.75,43.31 57.28,41.78 IC7.7
IO19  (via drill 0.4)
  Top 0.61: IC6.31 10.03,43.05 v9.91,42.93
  Bottom 0.203: v9.91,42.93 9.91,45.97 10.16,46.23 26.8,46.23 29.21,43.81 56.01,43.81 56.77,43.05 IC7.8
IO21  (via drill 0.4)
  Top 0.61: IC6.33 7.49,43.31 v7.87,42.93
  Bottom 0.203: IC7.9 29.34,44.32 26.92,46.74 8.13,46.74 7.87,46.48 v7.87,42.93
IO25  (via drill 0.4)
  Top 0.61: IC6.10 12.57,29.33 v12.7,29.46
  Bottom 0.203: IC8.4 57.78,20.95 50.55,28.19 35.81,28.19 34.8,27.18 13.46,27.18 12.7,27.94 v12.7,29.46
IO26  (via drill 0.4)
  Top 0.61: IC6.11 13.84,29.33 v13.97,29.46
  Bottom 0.203: IC8.5 57.28,22.22 50.8,28.7 35.56,28.7 34.54,27.69 14.48,27.69 13.97,28.19 v13.97,29.46
IO27  (via drill 0.4)
  Top 0.61: IC6.12 15.11,29.33 v15.24,29.46
  Bottom 0.203: IC8.6 56.77,23.49 51.05,29.21 35.31,29.21 34.29,28.19 15.49,28.19 15.24,28.45 v15.24,29.46
IO32  (via drill 0.4)
  Top 0.61: IC6.8 10.03,29.33 v10.16,29.46
  Bottom 0.203: IC8.2 58.8,18.41 50.04,27.18 36.32,27.18 35.31,26.16 11.43,26.16 10.16,27.43 v10.16,29.46
IO33  (via drill 0.4)
  Top 0.61: IC6.9 11.3,29.33 v11.43,29.46
  Bottom 0.203: IC8.3 58.29,19.68 50.29,27.69 36.07,27.69 35.05,26.67 12.19,26.67 11.43,27.43 v11.43,29.46
IO34  (via drill 0.4)  (1 unrouted)
  Top 0.305: IC6.6 v7.49,25.79
  Bottom 0.406: IC1.3 12.57,20.57 | R8.1 12.7,20.7 12.57,20.57 | 12.57,20.57 12.57,22.22 10.67,24.13 9.14,24.13 v7.49,25.78
IO35  (via drill 0.4)
  Top 0.203: IC6.7 8.89,27.43 8.89,24.38 9.14,24.13 10.41,22.86 22.35,22.86 v26.67,18.54 | X1.2 83.84,9 83.57,9.27 v70.99,9.27
  Bottom 0.203: 83.82,4.56 X1.2 | v70.99,9.27 70.87,9.4 67.82,9.4 66.04,11.18 52.83,11.18 48.01,16 41.15,16 39.62,17.53 27.69,17.53 v26.67,18.54
  Bottom 0.61: 83.84,6.37 R9.2 83.82,6.39 83.82,4.56
LATCH  (via drill 0.4)
  Top 0.203: JP1.14 95,17.53 93.22,17.53 92.96,17.78 v72.64,17.78
  Bottom 0.61: IC8.18 71.75,19.68 72.64,18.8 v72.64,17.78
LED  (via drill 0.4)
  Top 0.406: v45.47,24.64 45.47,36.07 45.97,36.58 v62.99,36.58
  Bottom 0.406: IC7.15 63.63,40.51 62.99,39.88 v62.99,36.58 | R14.2 43.43,22.61 v45.47,24.64
N$1
  Bottom 0.406: D2.C D1.C 12.57,7.22 IC1.14
N$2  (via drill 0.38)
  Top 0.61: v2.54,18.03 LED1.A
  Bottom 0.61: R13.1 v2.54,18.03
N$5
  Top 0.406: LED2.A 31.84,25.82 32.51,25.15 32.51,19.32 S1.A
  Bottom 0.61: S1.A 32.49,22.24 R14.1
N$25  (via drill 0.38)
  Top 0.305: IC3.5 64.49,6.35 v64.16,6.03
  Bottom 0.61: C9.1 64.23,6.1 v64.16,6.03 64.09,6.1 R12.2
N$32
  Bottom 0.406: IC1.1 10.03,18.41 9.87,18.58 R7.1
N$39
  Bottom 0.61: R4.1 R5.1 SJ1.2
N$47
  Bottom 0.61: D3.A J2.2
N$52  (via drill 0.4)
  Top 0.813: G1.+ 6.86,12.45 8.89,10.41 10.08,10.41 | 10.08,10.41 G2.P1"+" | 10.08,10.41 17.02,10.41 17.53,9.91 v17.53,4.06
  Top 1.016: G1.+ B1.+
  Bottom 0.61: D2.A 17.41,3.95 v17.53,4.06
OE  (via drill 0.4)
  Top 0.203: v73.91,16.51 93.47,16.51 JP1.15
  Bottom 0.203: IC8.17 72.52,20.95 73.91,19.56 v73.91,16.51
RED1  (via drill 0.4)
  Top 0.203: v73.41,39.37 74.42,40.39 92.2,40.39 93.73,38.86 JP1.1
  Bottom 0.203: IC7.16 73.28,39.24 v73.41,39.37
RED2
  Bottom 0.203: JP1.5 92.2,30.48 78.74,30.48 74.3,26.04 IC8.13
RX3V3  (via drill 0.4)
  Top 0.203: J2.5 34.29,6.86 34.29,16.76 36.32,18.8 36.32,20.32 34.29,22.35 34.29,37.85 33.78,38.35 22.61,38.35 v22.1,37.85
  Top 0.61: IC6.34 6.22,40.91 v6.23,40.9
  Bottom 0.203: v6.23,40.9 6.49,40.64 14.73,40.64 17.02,38.35 21.59,38.35 v22.1,37.85
SCL  (via drill 0.4)
  Top 0.203: J5.1 80.44,19.73 80.26,19.56 69.6,19.56 67.31,17.27 67.31,12.7 | 67.31,12.7 67.31,8.13 | 67.31,8.13 67.31,6.85 | v38.61,45.72 38.86,45.47 38.86,19.56 | 38.86,19.56 38.86,16 v38.61,15.75 | v67.06,12.7 67.31,12.7 | v38.61,19.56 38.86,19.56 | U1.SCK 77.19,4.34 76.96,4.57 74.93,4.57 74.68,4.83 74.68,7.11 73.91,7.87 69.34,7.87 v69.09,8.13 | v66.8,8.13 67.31,8.13
  Top 0.305: IC5.4 67.6,6.56 67.31,6.85 IC3.6
  Top 0.61: IC6.36 3.68,46.35 v3.81,46.48
  Bottom 0.203: v3.81,46.48 3.81,47.5 4.06,47.75 27.18,47.75 29.72,45.21 38.1,45.21 v38.61,45.72 | IC1.16 10.03,10.54 14.99,15.49 38.35,15.49 v38.61,15.75 | v67.06,12.7 54.36,12.7 49.53,17.53 42.42,17.53 40.39,19.56 v38.61,19.56 | v69.09,8.13 v66.8,8.13
  Bottom 0.406: IC1.16 10.03,6.64 R4.2
  Bottom 0.61: J4.1 J5.1
SDA  (via drill 0.4)
  Top 0.203: J5.2 82.44,19.7 81.79,19.05 69.85,19.05 67.82,17.02 67.82,11.94 | 67.82,11.94 67.82,7.62 68.07,7.37 69.85,7.37 | v39.37,46.48 39.37,18.8 | 39.37,18.8 v39.37,14.99 | v68.07,11.94 67.82,11.94 | v39.62,18.8 39.37,18.8 | IC5.3 69.67,5.91 69.85,6.1 69.85,7.37 | U1.DATA 74.19,6.83 73.66,7.37 69.85,7.37
  Top 0.305: IC3.4 67.56,5.85 67.56,5.84 67.63,5.91 IC5.3
  Top 0.61: IC6.37 2.41,46.36 v2.29,46.48
  Bottom 0.203: v2.29,46.48 2.29,47.75 2.79,48.26 27.3,48.26 29.84,45.72 37.59,45.72 38.35,46.48 v39.37,46.48 | IC1.15 11.3,11.05 15.24,14.99 v39.37,14.99 | v68.07,11.94 66.8,11.94 66.55,12.19 54.1,12.19 49.28,17.02 42.16,17.02 40.39,18.8 v39.62,18.8
  Bottom 0.406: IC1.15 11.3,6.77 R5.2
  Bottom 0.61: J4.2 J5.2
SVN  (via drill 0.4)
  Top 0.203: R1.2 53.59,2.54 52.32,3.81 v52.32,10.41 | v25.91,17.02 21.34,21.59 9.65,21.59 6.22,25.03 6.1,25.15 6.1,27.43 6.22,27.55 IC6.5
  Bottom 0.203: v25.91,17.02 39.37,17.02 40.89,15.49 47.75,15.49 52.32,10.92 v52.32,10.41
  Bottom 0.61: R1.2 63.16,2.63 R3.1 59.64,2.63 R2.2
TX3V3  (via drill 0.4)
  Top 0.203: J2.3 34.8,6.86 34.8,16.51 36.83,18.54 36.83,20.57 34.8,22.61 34.8,38.1 34.04,38.86 v22.1,38.86
  Top 0.61: IC6.35 4.95,43.06 v5.08,42.93
  Bottom 0.203: v22.1,38.86 17.27,38.86 14.99,41.15 7.11,41.15 5.33,42.93 v5.08,42.93
VCC  (via drill 0.4)
  Top 0.61: v50.04,34.16 SJ3.1 49.78,23.37 49.78,23.11 50.04,22.86 v50.04,21.84 | J3.5 82.8,14.99 70.61,14.99 v70.1,15.49
  Bottom 0.61: IC8.20 70.05,15.7 69.85,15.49 | 69.85,15.49 60.71,15.49 59.99,16.2 IC8.1 58.55,17.14 53.85,21.84 v50.04,21.84 | C15.1 IC7.20 IC7.1 v50.04,34.16 | J3.5 84.71,15.02 C14.1 | 69.85,15.49 v70.1,15.49 C16.1
VIN  (via drill 0.4)
  Top 0.61: 54.1,23.88 52.32,23.88 SJ3.2 | 54.1,23.88 C5.1 50.67,13.08 v50.67,9.14 | X2.2 74.93,46.48 | 74.93,46.48 74.93,45.47 74.17,44.7 71.12,44.7 66.04,39.62 66.04,33.53 64.77,32.26 v54.1,32.26 54.1,23.88 | SJ2.2 74.93,46.48
  Bottom 0.61: 46.84,9.14 IC4.3 | v54.1,32.26 30.73,32.26 IC2.OUT+ | IC4.3 50.57,9.04 v50.67,9.14 | C7.1 46.88,8.98 IC4.3

### Text on the board
tPlace: + | - | R1 04 / G1 12 / B1 13 / R2 14 / G2 15 / B2 21 | A 26 / B 05 / C 18 / D 19 / E 25 | CLOCK 27 / LATCH 32 / OE 33 | +5V | +12V | SDA 23 / SCL 22 | R1 | G1 | B1 | D 19 / C 18 / S 05 / W 26 | +3V3 | +5V | i2c | R2 | G2 | B2 | E | A | B | C | D | i2c | SCL | SDA | VCC | GND | CK | LA | SPI | OE | COM | WR | CS | HUB75 | T X | RX | R | 0 | 3V3 | VCC | GND | DHT22 | G | SDA